# EAGLE schematic mt2_redraw (EAGLE 8.5.1)
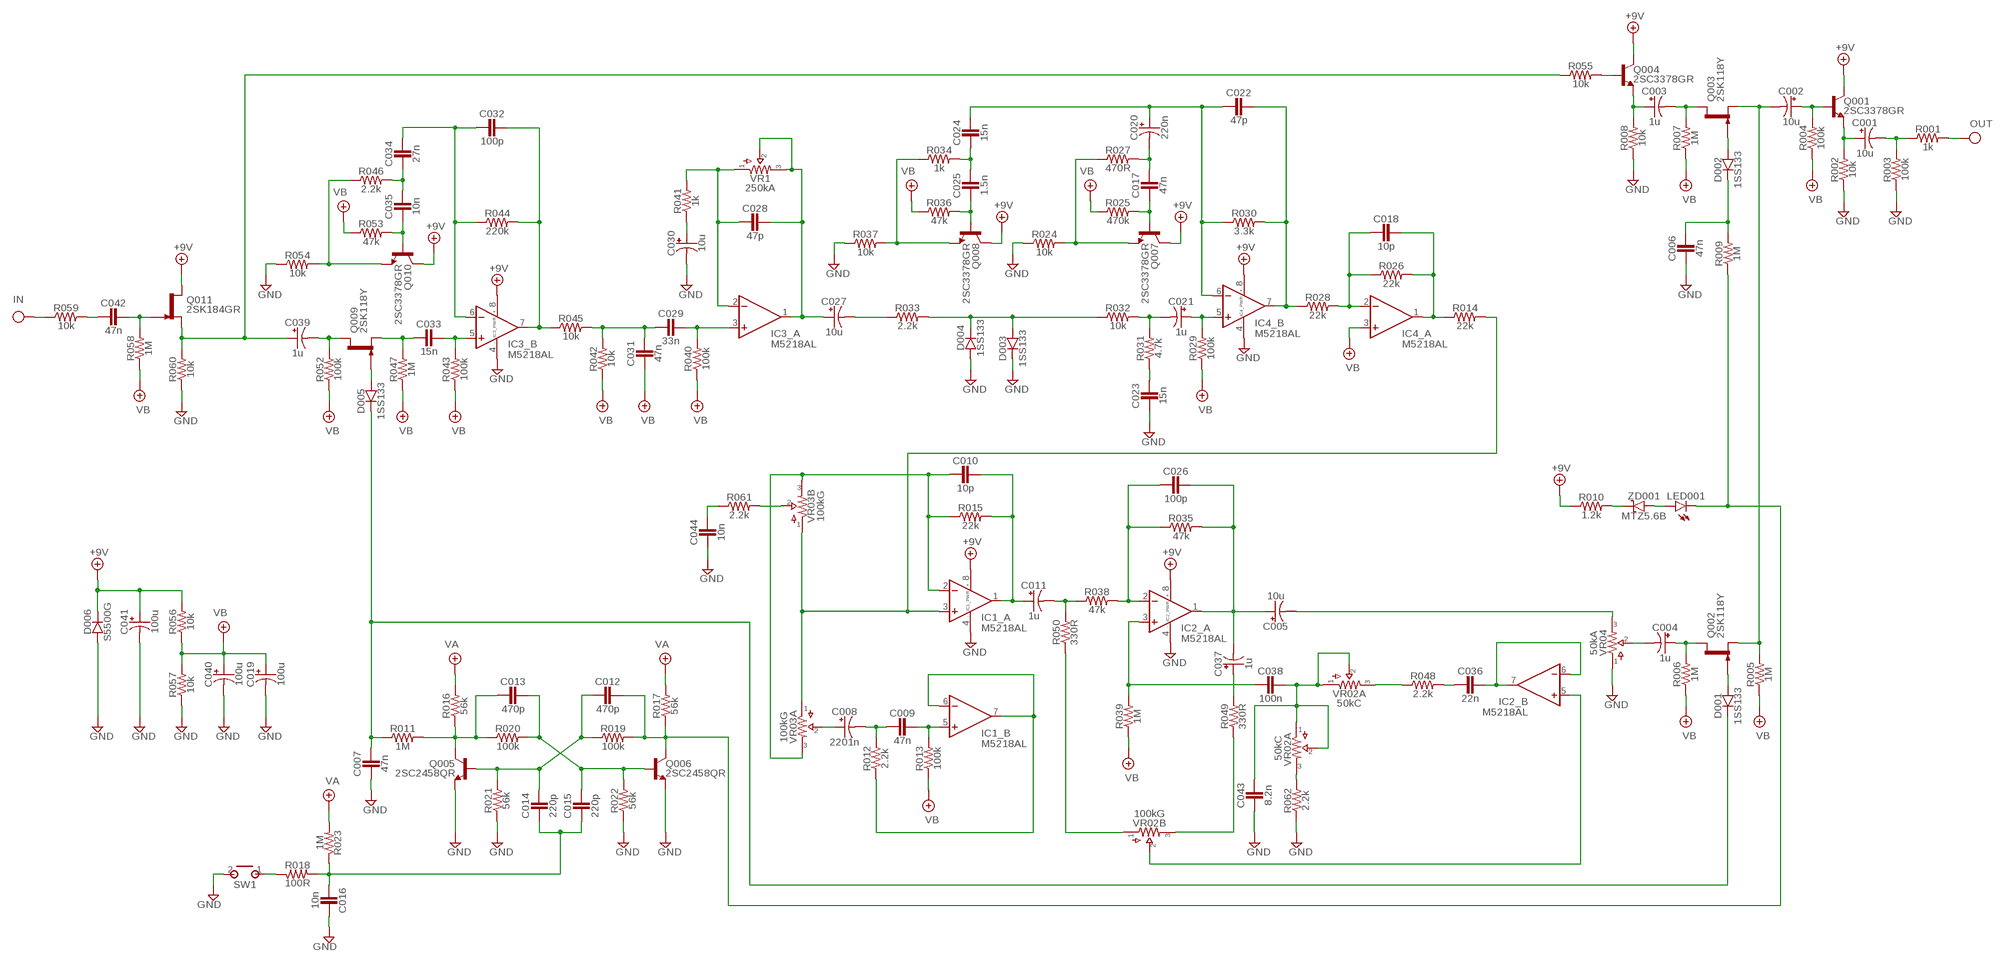
[diagram p0: schematic, sheet 1]

## Parts
C001  10u  0500  [050_020]
C002  10u  0500  [050_020]
C003  1u  0500  [050_020]
C004  1u  0500  [050_020]
C005  10u  0500  [050_020]
C006  47n  CER/FILMBOX.1  [BOX_SMALL]
C007  47n  CER/FILMBOX.1  [BOX_SMALL]
C008  2201n  0500  [050_020]
C009  47n  CER/FILMBOX.1  [BOX_SMALL]
C010  10p  CER/FILMBOX.1  [BOX_SMALL]
C011  1u  0500  [050_020]
C012  470p  CER/FILMBOX.1  [BOX_SMALL]
C013  470p  CER/FILMBOX.1  [BOX_SMALL]
C014  220p  CER/FILMBOX.1  [BOX_SMALL]
C015  220p  CER/FILMBOX.1  [BOX_SMALL]
C016  10n  CER/FILMBOX.1  [BOX_SMALL]
C017  47n  CER/FILMBOX.1  [BOX_SMALL]
C018  10p  CER/FILMBOX.1  [BOX_SMALL]
C019  100u  0500  [050_020]
C020  220n  0500  [050_020]
C021  1u  0500  [050_020]
C022  47p  CER/FILMBOX.1  [BOX_SMALL]
C023  15n  CER/FILMBOX.1  [BOX_SMALL]
C024  15n  CER/FILMBOX.1  [BOX_SMALL]
C025  1.5n  CER/FILMBOX.1  [BOX_SMALL]
C026  100p  CER/FILMBOX.1  [BOX_SMALL]
C027  10u  0500  [050_020]
C028  47p  CER/FILMBOX.1  [BOX_SMALL]
C029  33n  CER/FILMBOX.1  [BOX_SMALL]
C030  10u  0500  [050_020]
C031  47n  CER/FILMBOX.1  [BOX_SMALL]
C032  100p  CER/FILMBOX.1  [BOX_SMALL]
C033  15n  CER/FILMBOX.1  [BOX_SMALL]
C034  27n  CER/FILMBOX.1  [BOX_SMALL]
C035  10n  CER/FILMBOX.1  [BOX_SMALL]
C036  22n  CER/FILMBOX.1  [BOX_SMALL]
C037  1u  0500  [050_020]
C038  100n  CER/FILMBOX.1  [BOX_SMALL]
C039  1u  0500  [050_020]
C040  100u  0500  [050_020]
C041  100u  0500  [050_020]
C042  47n  CER/FILMBOX.1  [BOX_SMALL]
C043  8.2n  CER/FILMBOX.1  [BOX_SMALL]
C044  10n  CER/FILMBOX.1  [BOX_SMALL]
D001  1SS133  DO35.2  [DO35-2]
D002  1SS133  DO35.2  [DO35-2]
D003  1SS133  DO35.2  [DO35-2]
D004  1SS133  DO35.2  [DO35-2]
D005  1SS133  DO35.2  [DO35-2]
D006  S5500G  DO35.2  [DO35-2]
IC1  M5218AL  DUALTH  [DIL0]
IC2  M5218AL  DUALTH  [DIL0]
IC3  M5218AL  DUALTH  [DIL0]
IC4  M5218AL  DUALTH  [DIL0]
LED001  LED  [3MM_D]
Q001  2SC3378GR  2N3904  [TO92-]
Q002  2SK118Y  2N5457  [TO92-]
Q003  2SK118Y  2N5457  [TO92-]
Q004  2SC3378GR  2N3904  [TO92-]
Q005  2SC2458QR  2SC828A  [TO92-]
Q006  2SC2458QR  2SC828A  [TO92-]
Q007  2SC3378GR  2N3904  [TO92-]
Q008  2SC3378GR  2N3904  [TO92-]
Q009  2SK118Y  2N5457  [TO92-]
Q010  2SC3378GR  2N3904  [TO92-]
Q011  2SK184GR  2N5457  [TO92-]
R001  1k  R_.3B  [R0207/3]
R002  10k  R_.3B  [R0207/3]
R003  100k  R_.3B  [R0207/3]
R004  100k  R_.3B  [R0207/3]
R005  1M  R_.3B  [R0207/3]
R006  1M  R_.3B  [R0207/3]
R007  1M  R_.3B  [R0207/3]
R008  10k  R_.3B  [R0207/3]
R009  1M  R_.3B  [R0207/3]
R010  1.2k  R_.3B  [R0207/3]
R011  1M  R_.3B  [R0207/3]
R012  2.2k  R_.3B  [R0207/3]
R013  100k  R_.3B  [R0207/3]
R014  22k  R_.3B  [R0207/3]
R015  22k  R_.3B  [R0207/3]
R016  56k  R_.3B  [R0207/3]
R017  56k  R_.3B  [R0207/3]
R018  100R  R_.3B  [R0207/3]
R019  100k  R_.3B  [R0207/3]
R020  100k  R_.3B  [R0207/3]
R021  56k  R_.3B  [R0207/3]
R022  56k  R_.3B  [R0207/3]
R023  1M  R_.3B  [R0207/3]
R024  10k  R_.3B  [R0207/3]
R025  470k  R_.3B  [R0207/3]
R026  22k  R_.3B  [R0207/3]
R027  470R  R_.3B  [R0207/3]
R028  22k  R_.3B  [R0207/3]
R029  100k  R_.3B  [R0207/3]
R030  3.3k  R_.3B  [R0207/3]
R031  4.7k  R_.3B  [R0207/3]
R032  10k  R_.3B  [R0207/3]
R033  2.2k  R_.3B  [R0207/3]
R034  1k  R_.3B  [R0207/3]
R035  47k  R_.3B  [R0207/3]
R036  47k  R_.3B  [R0207/3]
R037  10k  R_.3B  [R0207/3]
R038  47k  R_.3B  [R0207/3]
R039  1M  R_.3B  [R0207/3]
R040  100k  R_.3B  [R0207/3]
R041  1k  R_.3B  [R0207/3]
R042  10k  R_.3B  [R0207/3]
R043  100k  R_.3B  [R0207/3]
R044  220k  R_.3B  [R0207/3]
R045  10k  R_.3B  [R0207/3]
R046  2.2k  R_.3B  [R0207/3]
R047  1M  R_.3B  [R0207/3]
R048  2.2k  R_.3B  [R0207/3]
R049  330R  R_.3B  [R0207/3]
R050  330R  R_.3B  [R0207/3]
R052  100k  R_.3B  [R0207/3]
R053  47k  R_.3B  [R0207/3]
R054  10k  R_.3B  [R0207/3]
R055  10k  R_.3B  [R0207/3]
R056  10k  R_.3B  [R0207/3]
R057  10k  R_.3B  [R0207/3]
R058  1M  R_.3B  [R0207/3]
R059  10k  R_.3B  [R0207/3]
R060  10k  R_.3B  [R0207/3]
R061  2.2k  R_.3B  [R0207/3]
R062  2.2k  R_.3B  [R0207/3]
SW1  MOMENTARY  [SPST]
VR1  250kA  POTS16MM  [16MM]
VR02A  50kC  POTS16MM  [16MM]
VR02A   50kC  POTS16MM  [16MM]
VR02B  100kG  POTS16MM  [16MM]
VR03A  100kG  POTS16MM  [16MM]
VR03B  100kG  POTS16MM  [16MM]
VR04  50kA  POTS16MM  [16MM]
ZD001  MTZ5.6B  ZENER.2  [DO41-2]

## Nets
+9V: C041.+ D006.C IC1.8(_PWR:V+) IC2.8(_PWR:V+) IC3.8(_PWR:V+) IC4.8(_PWR:V+) Q001.1(C) Q004.1(C) Q007.1(C) Q008.1(C) Q010.1(C) Q011.3(D) R010.1 R056.2
GND: C006.2 C007.2 C016.2 C019.- C023.2 C030.- C040.- C041.- C043.2 C044.2 D003.C D004.A D006.A IC1.4(_PWR:V-) IC2.4(_PWR:V-) IC3.4(_PWR:V-) IC4.4(_PWR:V-) Q005.3(E) Q006.3(E) R002.1 R003.1 R008.1 R021.1 R022.1 R024.1 R037.1 R054.1 R057.1 R060.1 R062.1 SW1.2(S) VR04.1
IN: R059.1
N$1: C044.1 R061.1
N$3: C039.- Q009.3(D) R052.2
N$4: C042.2 R059.2
N$5: C042.1 Q011.1(G) R058.2
N$6: D005.A Q009.1(G)
N$7: C033.2 Q009.2(S) R047.2
N$8: C033.1 IC3.5(_B:+IN) R043.2
N$9: C032.2 C034.1 IC3.6(_B:-IN) R044.1
N$10: C032.1 IC3.7(_B:OUT) R044.2 R045.1
N$11: C029.2 C031.1 R042.2 R045.2
N$12: C034.2 C035.1 R046.2
N$13: C035.2 Q010.2(B) R053.2
N$14: C029.1 IC3.3(_A:+IN) R040.2
N$15: Q010.3(E) R046.1 R054.2
N$16: C028.2 IC3.2(_A:-IN) R041.2 VR1.1
N$17: C005.- VR04.3
N$18: C027.- R033.1
N$19: C030.+ R041.1
N$20: D003.A D004.C R032.1 R033.2
N$21: C021.- R031.2 R032.2
N$22: C023.1 R031.1
N$23: C021.+ IC4.5(_B:+IN) R029.2
N$24: C024.2 C025.1 R034.2
N$25: C017.1 C020.- R027.2
N$26: C017.2 Q007.2(B) R025.2
N$27: Q007.3(E) R024.2 R027.1
N$29: C013.2 Q005.2(C) R011.2 R016.1 R020.1
N$30: C025.2 Q008.2(B) R036.2
N$31: C012.1 LED001.P$1(C) Q006.2(C) R009.1 R017.1 R019.2
N$32: C012.2 C014.1 Q005.1(B) R019.1 R021.2
N$33: Q008.3(E) R034.1 R037.2
N$34: C013.1 C015.1 Q006.1(B) R020.2 R022.2
N$35: C020.+ C022.2 C024.1 IC4.6(_B:-IN) R030.1
N$36: C022.1 IC4.7(_B:OUT) R028.1 R030.2
N$37: C018.2 IC4.2(_A:-IN) R026.1 R028.2
N$38: C018.1 IC4.1(_A:OUT) R014.1 R026.2
N$39: IC1.3(_A:+IN) R014.2 VR03A.1 VR03B.1
N$40: R061.2 VR03B.2
N$42: C010.2 IC1.2(_A:-IN) R015.1 VR03A.3 VR03B.3
N$43: C010.1 C011.+ IC1.1(_A:OUT) R015.2
N$44: C011.- R038.1 R050.2
N$45: C008.+ VR03A.2
N$46: C008.- C009.2 R012.2
N$47: IC1.6(_B:-IN) IC1.7(_B:OUT) R012.1
N$48: C009.1 IC1.5(_B:+IN) R013.2
N$49: C026.2 IC2.2(_A:-IN) R035.1 R038.2
N$50: C005.+ C026.1 C037.- IC2.1(_A:OUT) R035.2
N$51: C037.+ R049.2
N$52: R049.1 VR02B.3
N$53: C038.2 IC2.3(_A:+IN) R039.2
N$54: R050.1 VR02B.1
N$55: C038.1 C043.1 VR02A.1 VR02A.2 VR02A .1 VR02A .2
N$56: R062.2 VR02A .3
N$57: R048.1 VR02A.3
N$58: R018.2 SW1.1(P)
N$59: C036.2 R048.2
N$60: C036.1 IC2.6(_B:-IN) IC2.7(_B:OUT)
N$62: IC2.5(_B:+IN) VR02B.2
N$63: C004.- VR04.2
N$64: C004.+ Q002.3(D) R006.2
N$65: D001.A Q002.1(G)
N$66: C002.- Q002.2(S) Q003.2(S) R005.2
N$67: Q004.2(B) R055.2
N$68: C003.+ Q004.3(E) R008.2
N$69: C003.- Q003.3(D) R007.2
N$70: D002.A Q003.1(G)
N$71: C014.2 C015.2 C016.1 R018.1 R023.1
N$72: C006.1 D002.C R009.2
N$73: C002.+ Q001.2(B) R004.2
N$74: C001.+ Q001.3(E) R002.2
N$75: C001.- R001.1 R003.2
N$77: C007.1 D001.C D005.C R011.1
N$78: R010.2 ZD001.C
N$79: LED001.ANODE(A) ZD001.A
N$81: C027.+ C028.1 IC3.1(_A:OUT) VR1.2 VR1.3
N$83: C039.+ Q011.2(S) R055.1 R060.2
OUT: R001.2
VA: R016.2 R017.2 R023.2
VB: C019.+ C031.2 C040.+ IC4.3(_A:+IN) R004.1 R005.1 R006.1 R007.1 R013.1 R025.1 R029.1 R036.1 R039.1 R040.1 R042.1 R043.1 R047.1 R052.1 R053.1 R056.1 R057.2 R058.1

## Library data of the parts
C001-C005 C008 C011 C019-C021 C027 C030 C037 C039-C041 = pedals-capacitors-elec:050
C006 C007 C009 C010 C012-C018 C022-C026 C028 C029 C031-C036 C038 C042-C044 = pedals-capacitors-film:CER/FILM: 47 - 120pF Xicon Ceramic Disc 2.5mm lead spacing
D001-D006 = pedals-diodes:DO35: DO-35 Package Diodes: 1N914
IC1-IC4 = pedals-integrated circuits:DUAL: OP AMP
LED001 = pedals-diodes:LED
Q001 Q004 Q007 Q008 Q010 = pedals-transistors:2N3904: NPN Transistor
Q002 Q003 Q009 Q011 = pedals-transistors:2N5457: N-CHANNEL JFET
Q005 Q006 = pedals-transistors:2SC828A
R001-R009 R010-R050 R052-R062 = pedals-resistors:R_
SW1 = pedals-switches:MOMENTARY
VR1 VR02A VR02A  VR02B VR03A VR03B VR04 = pedals-potentiometers:POTS
ZD001 = pedals-diodes:ZENER